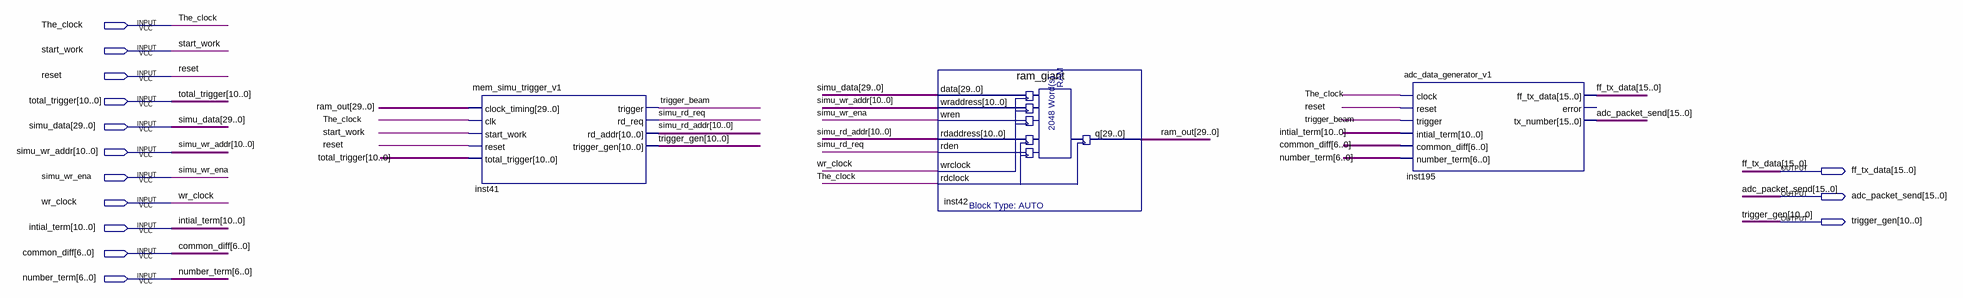
[diagram p0: schematic sheet]
// Quartus schematic adc_data_simu.bdf as structural Verilog: 3 symbols, 14 pins
module adc_data_simu (
  input  The_clock,
  input  start_work,
  input  reset,
  input  [10:0] total_trigger,
  input  [29:0] simu_data,
  input  [10:0] simu_wr_addr,
  input  simu_wr_ena,
  input  wr_clock,
  input  [10:0] intial_term,
  input  [6:0] common_diff,
  input  [6:0] number_term,
  output [15:0] ff_tx_data,
  output [15:0] adc_packet_send,
  output [10:0] trigger_gen
);

  wire simu_rd_req, trigger_beam;
  wire [10:0] simu_rd_addr;
  wire [29:0] ram_out;

  mem_simu_trigger_v1 inst41 (
    .clock_timing(ram_out), .clk(The_clock), .start_work(start_work), .reset(reset),
    .total_trigger(total_trigger), .trigger(trigger_beam), .rd_req(simu_rd_req), .rd_addr(simu_rd_addr),
    .trigger_gen(trigger_gen));
  ram_giant inst42 (
    .data(simu_data), .wraddress(simu_wr_addr), .wren(simu_wr_ena), .rdaddress(simu_rd_addr),
    .rden(simu_rd_req), .wrclock(wr_clock), .rdclock(The_clock), .q(ram_out));
  adc_data_generator_v1 inst195 (
    .clock(The_clock), .reset(reset), .trigger(trigger_beam), .intial_term(intial_term),
    .common_diff(common_diff), .number_term(number_term), .ff_tx_data(ff_tx_data), .tx_number(adc_packet_send));  // open: error
endmodule
